# EasyEDA Pro project ProPrj_FOC12_2025-04-03.epro, board PCB3
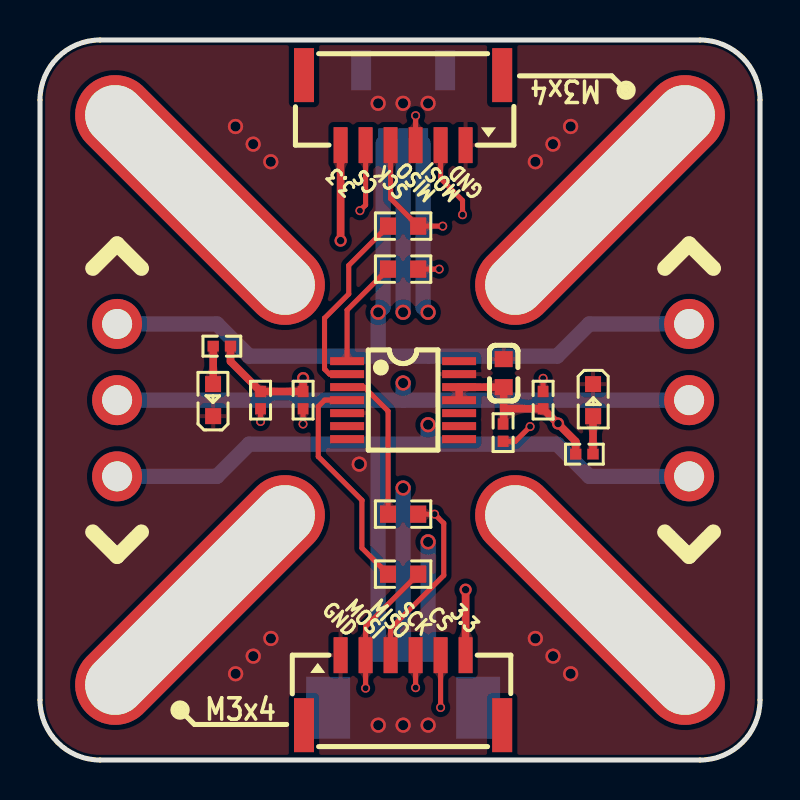
[diagram p6: board, top side]
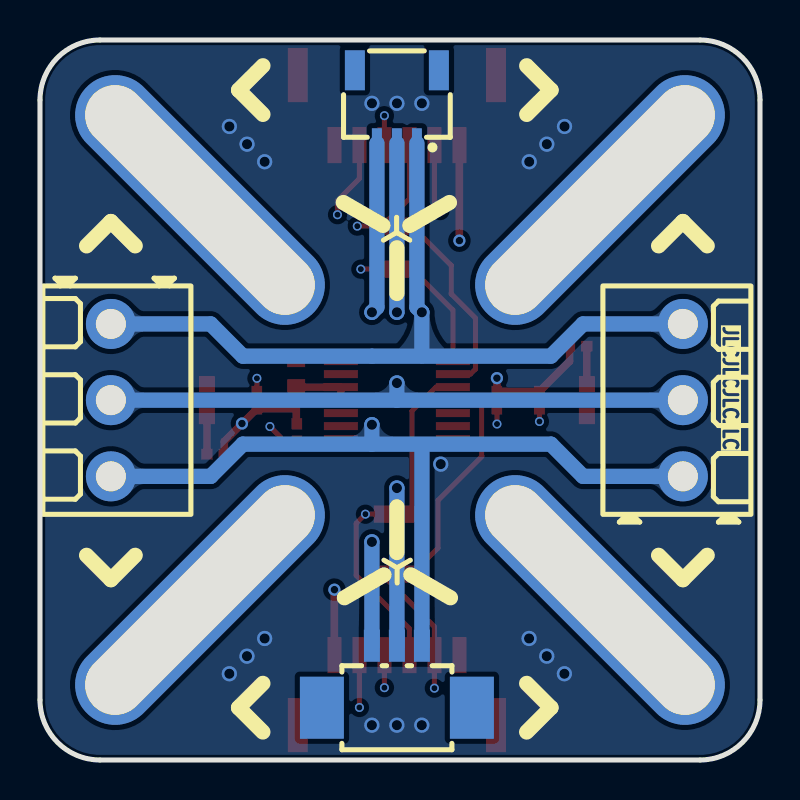
[diagram p7: board, bottom side, seen from below]

Outline 36 x 36 mm; copper layers: Top Layer, Inner1, Inner2, Bottom Layer. Coordinates in mm from the lower left corner of the outline.
Outline path: 0,33 arc(0.88,35.12) 3,36 33,36 arc(35.12,35.12) 36,33 36,3 arc(35.12,0.88) 33,0 3,0 arc(0.88,0.88) 0,3 0,33
Stack: Top Layer 0.035mm 外层铜厚1oz / Dielectric1 0.2104mm 7628 RC49% 8.6mil / Inner1 0.0152mm 内层铜厚 / Dielectric2 1.065mm 1.1mm H/HOZ Copper / Inner2 0.0152mm 内层铜厚 / Dielectric3 0.2104mm 7628 RC49% 8.6mil / Bottom Layer 0.035mm 外层铜厚1oz

## Design rules (mm)
template: 自定义配置
spacing copperThickness1oz (default): track to track 0.102, other pairs 0.152 to 0.3
spacing copperThickness2oz: track to track 0.203, other pairs 0.152 to 0.3
track width copperThickness1oz (default): min 0.127, default 0.254, max 2.54
track width copperThickness2oz: min 0.203, default 0.254, max 2.54
differential pair differentialPair (default): width min 0.127, default 0.254, max 2.54; gap min 0.152, default 0.152
via viaSize (default): diameter min 0.45, default 0.61, max 10; hole min 0.3, default 0.305, max 6.299

## Placement (name value [footprint] x y rotation side)
C1  100nF  [C0603]  23.18 19.34 270 top
CN1  DB125-3.81-3P-RD-S  [CONN-TH_3P-P3.81_L7.4-W11.4]  3.85 17.99 90 bottom
CN2  DB125-3.81-3P-RD-S  [CONN-TH_3P-P3.81_L7.4-W11.4]  32.45 17.99 270 bottom
CN5  HC-1.0-3PWT  [CONN-SMD_3P-P1.0-HC-1.0-3PWT]  18.15 32.66 0 bottom
LED1  XL-1608UBC-04_蓝  [LED0603-RD_BLUE]  8.65 17.99 90 top
LED2  XL-1608UBC-04_蓝  [LED0603-RD_BLUE]  27.65 17.99 270 top
NOREF  -  [Pad_e81]  28 8 135 top
NOREF#2  -  [Pad_e80]  8 8 225 top
NOREF#3  -  [Pad_e78]  8 28 135 top
NOREF#4  -  [Pad_e79]  28 28 225 top
R1  10kΩ  [R0402]  23.15 16.37 270 top
R2  10kΩ  [R0402]  13.15 17.99 270 top
R3  10kΩ  [R0402]  25.15 17.99 270 top
R4  10kΩ  [R0402]  11.03 17.99 270 top
R5  1kΩ  [R0402]  9.09 20.69 0 top
R6  22Ω  [R0603]  18.15 24.54 0 top
R7  22Ω  [R0603]  18.15 26.69 0 top
R8  22Ω  [R0603]  18.15 12.29 0 top
R9  22Ω  [R0603]  18.15 9.29 0 top
R10  1kΩ  [R0402]  27.22 15.29 180 top
U1  532610371  [CONN-TH_532610371]  18.15 4.16 180 bottom
U2  AS5047P-ATSM  [TSSOP-14_L5.0-W4.4-P0.65-LS6.4-BL]  18.15 17.99 270 top
U3  HC-GH-6PWT  [CONN-SMD_6P-P1.25_HCTL_HC-GH-6PWT]  18.15 3.49 0 top
U4  HC-GH-6PWT  [CONN-SMD_6P-P1.25_HCTL_HC-GH-6PWT]  18.15 32.49 180 top

## Footprints (pads in the part's own frame, mm; a bottom-side part is the same pattern mirrored in y, then rotated)
C0603
  rect 0.8x0.9 smd: 1(-0.7,0) 2(0.7,0)
CONN-SMD_3P-P1.0-HC-1.0-3PWT
  rect 0.5x1.5 smd: 1(-1,1.825) 2(0,1.825) 3(1,1.825)
  rect 1x2 smd: 4(-2.1,-1.825) 5(2.1,-1.825)
CONN-SMD_6P-P1.25_HCTL_HC-GH-6PWT
  rect 0.7x1.8 smd: 1(-3.125,1.75) 2(-1.875,1.75) 3(-0.625,1.75) 4(0.625,1.75) 5(1.875,1.75) 6(3.125,1.75)
  rect 1x2.7 smd: 7(4.955,-1.75) 8(-4.955,-1.75)
CONN-TH_3P-P3.81_L7.4-W11.4
  round 2.5 hole 1.5: 1(-3.81,0) 2(0,0) 3(3.81,0)
CONN-TH_532610371
  rect 0.8x1.6 smd: 1(-1.25,1.55) 2(0,1.55) 3(1.25,1.55)
  rect 2.2x3.1 smd: 4(3.75,-1.55) 5(-3.75,-1.55)
LED0603-RD_BLUE
  rect 0.8x0.8 smd: 1(-0.8,-0.003) 2(0.8,0.003)
Pad_e78
  oval 16x4 hole 15x3: 1(0,0)
Pad_e79
  oval 16x4 hole 15x3: 1(0,0)
Pad_e80
  oval 16x4 hole 15x3: 1(0,0)
Pad_e81
  oval 16x4 hole 15x3: 1(0,0)
R0402
  rect 0.566x0.54 smd: 1(-0.433,0) 2(0.433,0)
R0603
  rect 0.806x0.864 smd: 1(-0.753,0) 2(0.753,0)
TSSOP-14_L5.0-W4.4-P0.65-LS6.4-BL
  rect 0.4x1.7 smd: 1(-1.95,-2.8) 2(-1.3,-2.8) 3(-0.65,-2.8) 4(0,-2.8) 5(0.65,-2.8) 6(1.3,-2.8) 7(1.95,-2.8) 8(1.95,2.8) 9(1.3,2.8) 10(0.65,2.8) 11(0,2.8) 12(-0.65,2.8) 13(-1.3,2.8) 14(-1.95,2.8)

## Nets
As in the schematic.

Pads without a net: CN5 4 5; NOREF 1; NOREF#2 1; NOREF#3 1; NOREF#4 1; U1 4 5; U2 6 7 8 9 10 14; U3 7 8; U4 7 8

## Via types
v1: diameter 0.45, hole 0.305, Top Layer to Bottom Layer, 13 vias
v2: diameter 0.61, hole 0.381, Top Layer to Bottom Layer, 4 vias
v3: diameter 0.762, hole 0.508, Top Layer to Bottom Layer, 26 vias

## Routing (per net, layer and track width the routed paths; a pad name or vN(x,y) marks a point on that pad's centre or on a via; arc(x,y) is an arc through that point)
+3.3V_1: length 52.6
  Top Layer w0.381: 15.03,30.76 v2(15.03,25.97) ; 23.18,17.56 C1.2 U2.12 U2.11 ; 23.18,17.56 23.18,16.83 R1.1 ; 23.18,17.56 R3.2 26.78,15.93 R10.2 ; 21.28,5.22 v2(21.28,8.52) ; R5.2 9.52,19.93 R4.1 R2.1 v2(13.15,19.09)
  Inner1 w0.381: 20.67,15.2 19.82,15.2 15.92,19.09 ; 20.67,15.2 20.67,9.13 v2(21.28,8.52) ; 20.67,15.2 24.28,15.2 v2(25.9,16.82) ; 15.92,19.09 15.92,25.08 v2(15.03,25.97) ; 15.92,19.09 v2(13.15,19.09)
DGND:
  vias: v3(9.77,31.68) v3(9.78,4.31) v3(10.66,30.79) v3(10.66,5.19) v3(11.54,29.91) v3(11.55,6.08) v3(15.96,14.79) v3(16.91,32.83) v3(16.91,1.74) v3(18.15,32.83) v3(18.16,1.74) v3(19.4,32.83) v3(19.41,1.74) v3(24.77,29.91) v3(24.77,6.08) v3(25.65,30.79) v3(25.65,5.19) v3(26.53,31.68) v3(26.53,4.31)
CLK: length 9.7
  Top Layer w0.254: R7.1 15.44,24.73 15.44,23.3 14.23,22.09 14.23,19.55 14.48,19.29 U2.2
CSN: length 5.4
  Top Layer w0.254: R6.1 15.35,22.5 U2.1
MISO: length 7.7
  Top Layer w0.254: R8.1 17.4,17.45 16.21,18.64 U2.3
MOSI: length 11.4
  Top Layer w0.254: R9.1 16.1,10.6 16.1,12.99 13.91,15.17 13.91,17.68 14.23,17.99 U2.4
U: length 59
  Inner2 w0.762: v3(19.4,10.91) 18.38,10.91 16.91,12.38 v3(16.91,22.39)
  Bottom Layer w0.762: U1.1 v3(19.4,10.91) ; CN5.1 17.15,22.63 v3(16.91,22.39) 16.91,20.2 ; CN2.1 27.46,21.8 25.85,20.19 10.45,20.19 8.84,21.8 CN1.3
V: length 54.6
  Inner2 w0.762: v3(18.15,13.6) v3(18.15,18.85) v3(18.15,22.39)
  Bottom Layer w0.762: CN2.2 18.15,17.99 ; 18.15,17.99 v3(18.15,18.85) ; 18.15,17.99 CN1.2 ; U1.2 v3(18.15,13.6) ; CN5.2 v3(18.15,22.39)
W: length 55.1
  Inner2 w0.762: v3(19.4,16.76) v3(19.4,22.39)
  Bottom Layer w0.762: CN1.1 8.84,14.18 10.45,15.79 19.4,15.79 ; CN5.3 19.15,22.64 v3(19.4,22.39) ; 19.4,15.79 25.85,15.79 27.46,14.18 CN2.3 ; 19.4,15.79 v3(19.4,16.76) ; U1.3 16.9,15.77
$1N1242: length 37.8
  Top Layer w0.254: R2.2 13.15,16.8 v1(13.15,16.8) ; R8.2 v1(19.73,12.29) 20.19,11.83 20.19,9.23 17.53,6.57 17.53,5.22 ; 18.78,30.76 v1(18.78,32.22)
  Inner1 w0.254: v1(13.15,16.8) 13.15,16.44 17.3,12.29 v1(19.73,12.29)
  Inner2 w0.254: v1(18.78,32.22) 18.78,25.25 14.83,21.29 14.83,19.29 13.15,17.61 v1(13.15,16.8)
$1N1859: length 1.9
  Top Layer w0.381: R5.1 8.66,18.8
  Top Layer w0.762: 8.66,18.8 LED1.2
$1N1862: length 1.9
  Top Layer w0.381: LED2.2 27.65,17.19 R10.1
$1N3469: length 45.6
  Top Layer w0.254: 20.03,5.22 v1(20.03,2.63) ; R6.2 v1(19.96,24.54) ; 16.28,30.76 16.28,27.75 v1(16,27.47) ; R4.2 v1(11.03,16.93)
  Inner1 w0.254: v1(20.03,2.63) 18.64,2.63 16.5,4.76 16.5,12.1 11.68,16.93 ; v1(11.03,16.93) 11.68,16.93 ; 11.68,16.93 11.68,18.86 14.93,22.11 14.93,24.72 14.24,25.41 14.24,26.78 14.93,27.47 v1(16,27.47) 18.92,24.54 v1(19.96,24.54)
$1N5453: length 36.2
  Top Layer w0.254: 18.78,5.22 v1(18.78,3.62) ; R3.1 v1(25.15,19.08) ; 17.53,30.76 17.53,28.07 R7.2 v1(20.14,26.69)
  Inner2 w0.254: 23.69,19.08 20.54,22.23 20.54,26.29 v1(20.14,26.69) ; 23.69,19.08 v1(25.15,19.08) ; 23.69,19.08 20.23,15.63 20.23,8.69 18.78,7.24 v1(18.78,3.62)
$1N5462: length 43.8
  Top Layer w0.254: v1(24.5,16.67) 23.77,15.94 R1.2 ; R9.2 16.28,6.66 U3.2 v1(16.28,3.59) ; 20.03,30.76 20.03,29.07 21.13,27.97 v1(21.13,27.26)
  Inner1 w0.254: v1(21.13,27.26) 21.13,20.05 v1(24.5,16.67)
  Inner2 w0.254: v1(16.28,3.59) 17.04,2.83 19.42,2.83 20.09,3.49 20.09,7.88 20.69,8.49 20.69,12.86 v1(24.5,16.67)

## Copper pours and planes (outline as drawn; the poured copper is in the pictures)
DGND on Top Layer: -0.35,36.67 36.47,36.67 36.47,-0.78 -0.35,-0.78
DGND on Bottom Layer: -0.35,36.67 36.47,36.67 36.47,-0.78 -0.35,-0.78
DGND on Inner1: -0.35,36.67 36.47,36.67 36.47,-0.78 -0.35,-0.78
DGND on Inner2: -0.35,36.67 36.47,36.67 36.47,-0.78 -0.35,-0.78

Small or netless copper shapes (teardrops, artwork), in the pictures only: 66 on Top Layer, 12 on Bottom Layer, 16 on Inner1, 8 on Inner2

## Text on the board
Bottom Silkscreen Layer: JLCJLCJLCJLC
Top Silkscreen Layer: 3.3 | MISO | MOSI | GND | CS | SCK | M3x4
